# Altium project ATMEGA8高仿PLC控制板.PRJPCB
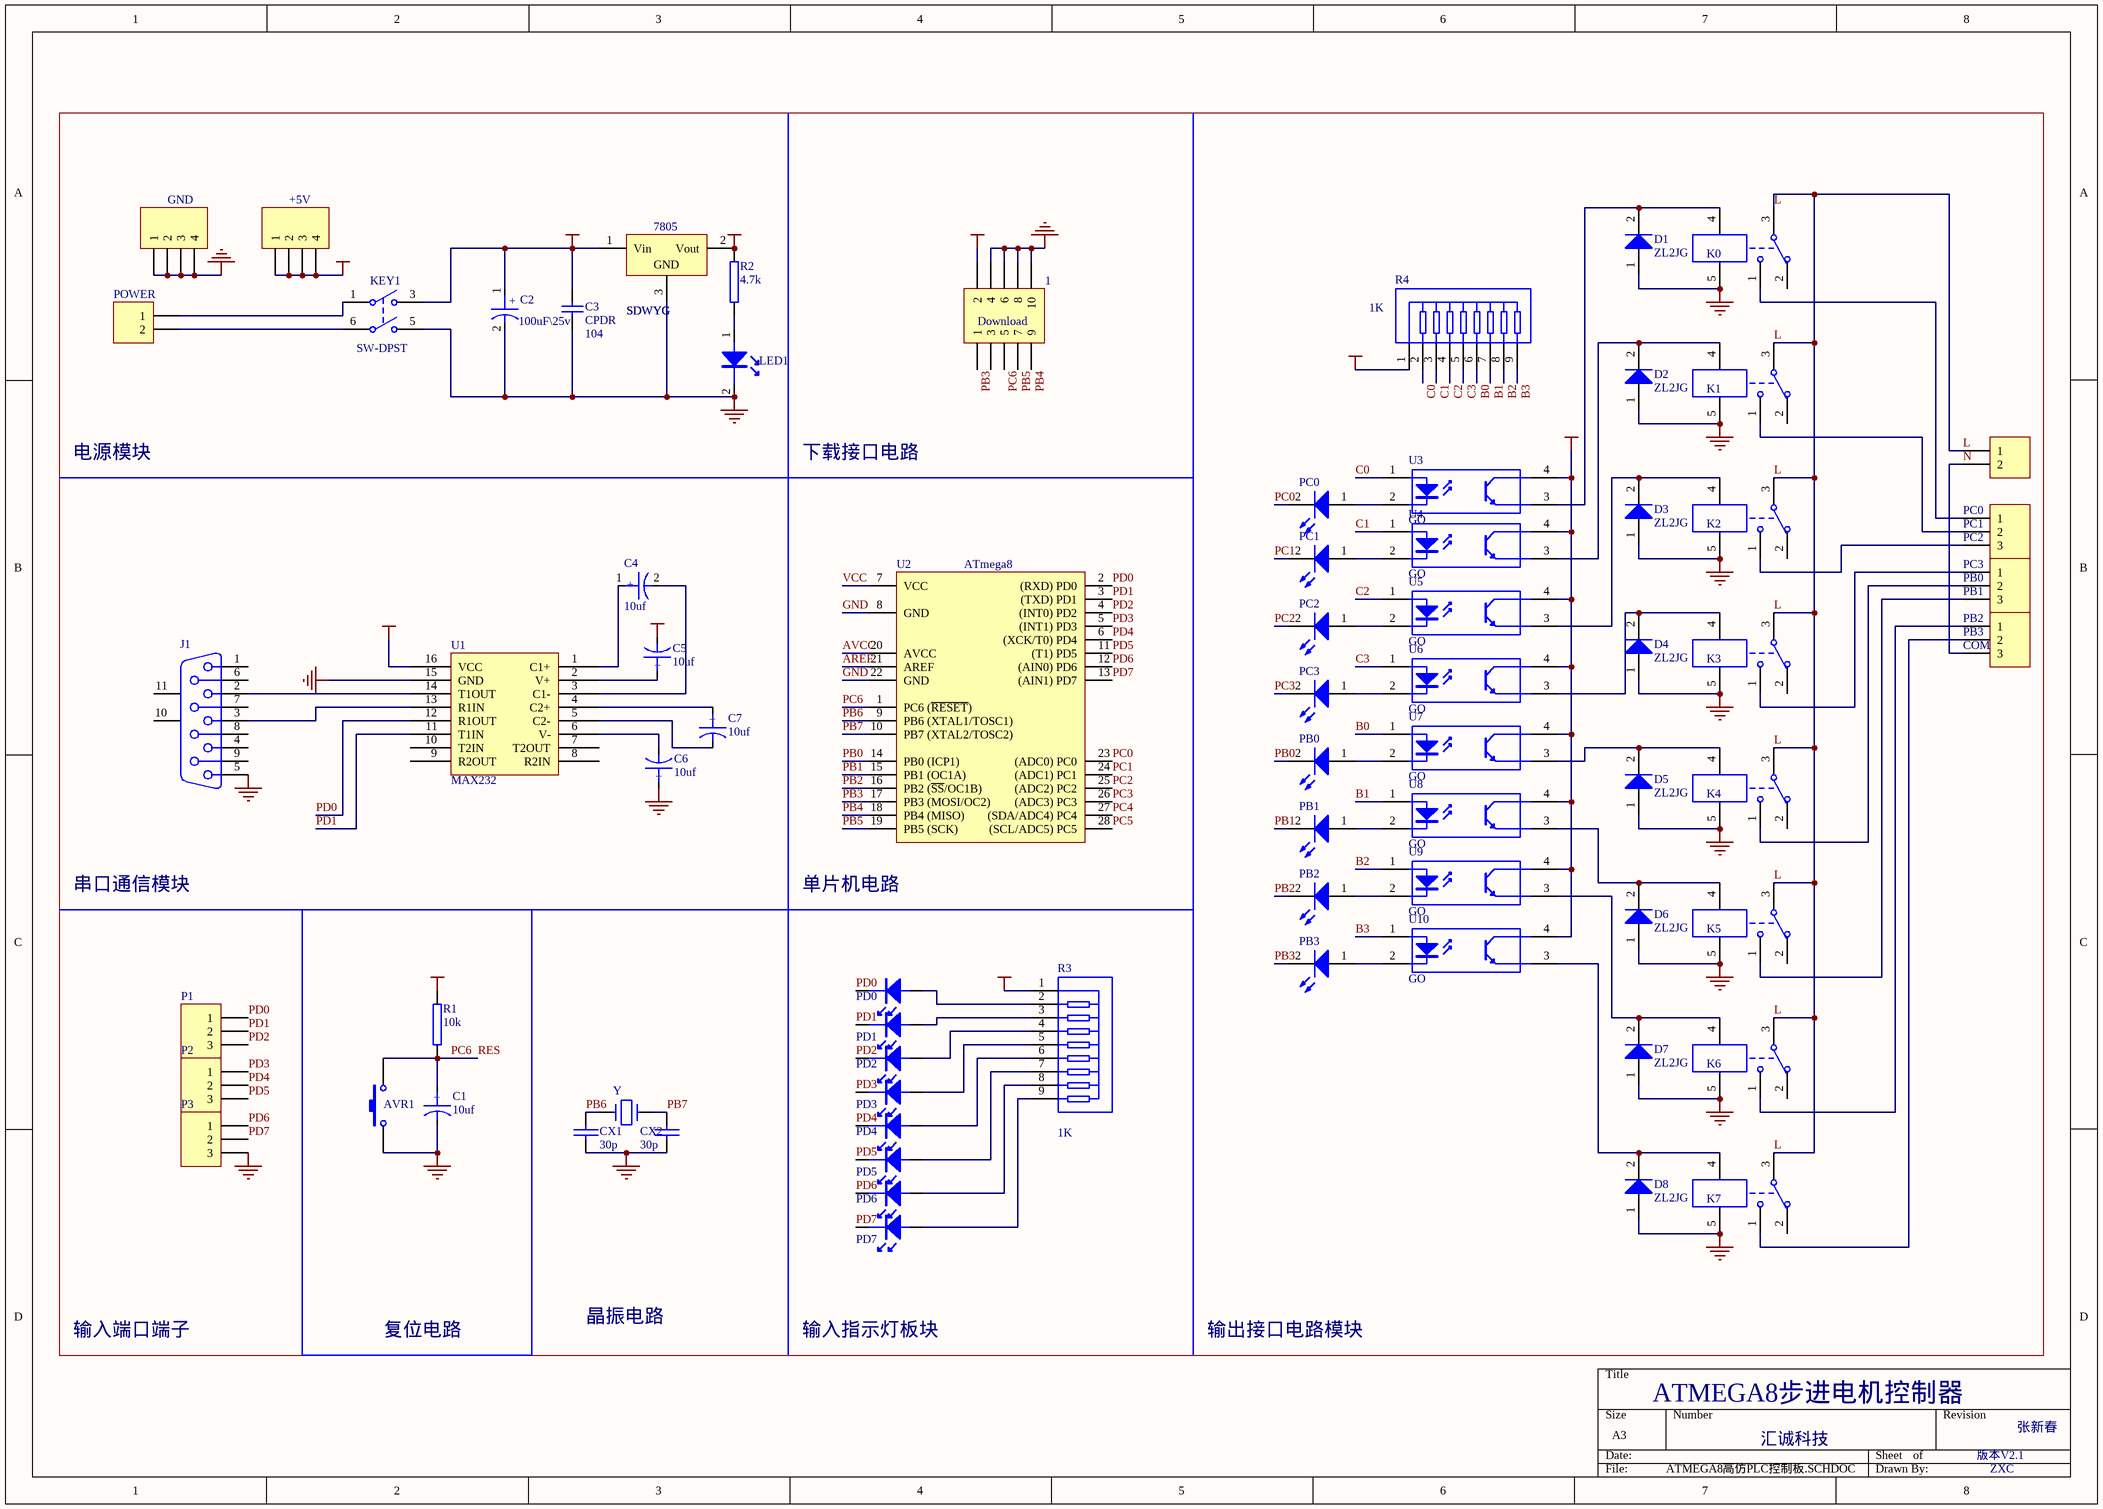
[diagram p0: ATMEGA8高仿PLC控制板.SCHDOC]
1 sheet, 72 parts. Net scope: global (net labels, ports and power ports of the same name join across sheets).
Board file: ATMEGA8高仿PLC控制板.PCBDOC

## Sheet ATMEGA8高仿PLC控制板.SCHDOC: tteter
size A3; DrawnBy: 12222; ertwertw: tertwet; Rule: PcbType=ProtelPcb; Rule: PcbType=ProtelPcb; Rule: PcbType=ProtelPcb; Rule: PcbType=ProtelPcb; Rule: PcbType=ProtelPcb

### Parts
1  Download  [HDR-2x5]
7805  SDWYG  [wyk]
+5V  (no value)  [HDR1X4]
AVR1  (no value)  [an-6*6]
C1  10uf  [C-DJ-4]
C2  100uF\25v  [C-DJ-6]
C3  CPDR  value 104  [CPDR]
C4  10uf  [C-DJ-4]
C5  10uf  [C-DJ-4]
C6  10uf  [C-DJ-4]
C7  10uf  [C-DJ-4]
CX1  30p  [HDR1X2]
CX2  30p  [HDR1X2]
D1  ZL2JG  [D-ZL-10]
D2  ZL2JG  [D-ZL-10]
D3  ZL2JG  [D-ZL-10]
D4  ZL2JG  [D-ZL-10]
D5  ZL2JG  [D-ZL-10]
D6  ZL2JG  [D-ZL-10]
D7  ZL2JG  [D-ZL-10]
D8  ZL2JG  [D-ZL-10]
GND  (no value)  [HDR1X4]
J1  D Connector 9  [DSUB1.385-2H9]  (value not drawn)
K0  JDQYCK  [JQC-3F/T73]  (value not drawn)
K1  JDQYCK  [JQC-3F/T73]  (value not drawn)
K2  JDQYCK  [JQC-3F/T73]  (value not drawn)
K3  JDQYCK  [JQC-3F/T73]  (value not drawn)
K4  JDQYCK  [JQC-3F/T73]  (value not drawn)
K5  JDQYCK  [JQC-3F/T73]  (value not drawn)
K6  JDQYCK  [JQC-3F/T73]  (value not drawn)
K7  JDQYCK  [JQC-3F/T73]  (value not drawn)
KEY1  SW-DPST  [DPDT-6]
LED1  LED  [LED]  (value not drawn)
P1  PZ_3  [JK128_3]
P2  PZ_3  [JK128_3]
P3  (no value)  [JK128_3]
P4  PZ_2  [DYDZ]  (value not drawn)
PB0  (no value)  [CPDR]
PB1  (no value)  [CPDR]
PB2  (no value)  [CPDR]
PB3  (no value)  [CPDR]
PC0  (no value)  [CPDR]
PC1  (no value)  [CPDR]
PC2  (no value)  [CPDR]
PC3  (no value)  [CPDR]
PD0  LED  [HDR1X2]  (value not drawn)
PD1  LED  [HDR1X2]  (value not drawn)
PD2  LED  [HDR1X2]  (value not drawn)
PD3  LED  [HDR1X2]  (value not drawn)
PD4  LED  [HDR1X2]  (value not drawn)
PD5  LED  [HDR1X2]  (value not drawn)
PD6  LED  [HDR1X2]  (value not drawn)
PD7  LED  [HDR1X2]  (value not drawn)
POUT1  PZ_3  [JK128_3]  (value not drawn)
POUT2  PZ_3  [JK128_3]  (value not drawn)
POUT3  PZ_3  [JK128_3]  (value not drawn)
POWER  (no value)  [JK128_2]
R1  10k  [RSE]
R2  4.7k  [RSE]
R3  value 1K  [HDR-10]
R4  value 1K  [HDR-10]
U1  MAX232  [DIP16]
U2  ATmega8  [DIP-28]
U3  GO  [DIP-4]
U4  GO  [DIP-4]
U5  GO  [DIP-4]
U6  GO  [DIP-4]
U7  GO  [DIP-4]
U8  GO  [DIP-4]
U9  GO  [DIP-4]
U10  GO  [DIP-4]
Y1  Y  [JZ_ZC]

### Nets
+12V: 7805.1(Vin) C2.1 C3.2 KEY1.3(NO1) U3.4(C) U4.4(C) U5.4(C) U6.4(C) U7.4(C) U8.4(C) U9.4(C) U10.4(C)
GND: 1.4 1.6 1.8 1.10 7805.3(GND) AVR1.2 C1.2 C2.2 C3.1 C6.1 CX1.2 CX2.2 D1.1(A) D2.1(A) D3.1(A) D4.1(A) D5.1(A) D6.1(A) D7.1(A) D8.1(A) GND.1 GND.2 GND.3 GND.4 J1.5 K0.5 K1.5 K2.5 K3.5 K4.5 K5.5 K6.5 K7.5 KEY1.5(NO2) LED1.2(K) P3.3 U1.15(GND) U2.8(GND) U2.22(GND)
VCC: 1.2 7805.2(Vout) +5V.1 +5V.2 +5V.3 +5V.4 C5.2 R1.2 R2.1 R3.1 R4.1 U1.16(VCC) U2.7(VCC)
AREF: U2.21(AREF)
AVCC: U2.20(AVCC)
B0: R4.6 U7.1(A)
B1: R4.7 U8.1(A)
B2: R4.8 U9.1(A)
B3: R4.9 U10.1(A)
C0: R4.2 U3.1(A)
C1: R4.3 U4.1(A)
C2: R4.4 U5.1(A)
C3: R4.5 U6.1(A)
L: K0.3 K1.3 K2.3 K3.3 K4.3 K5.3 K6.3 K7.3 P4.1
N: P4.2 POUT3.3
PB0: PB0.2(K) U2.14(PB0_(ICP1))
PB1: PB1.2(K) U2.15(PB1_(OC1A))
PB2: PB2.2(K) U2.16(PB2_(~{SS}/OC1B))
PB3: 1.1 PB3.2(K) U2.17(PB3_(MOSI/OC2))
PB4: 1.9 U2.18(PB4_(MISO))
PB5: 1.7 U2.19(PB5_(SCK))
PB6: CX1.1 U2.9(PB6_(XTAL1/TOSC1)) Y1.2
PB7: CX2.1 U2.10(PB7_(XTAL2/TOSC2)) Y1.1
PC0: PC0.2(K) U2.23((ADC0)_PC0)
PC1: PC1.2(K) U2.24((ADC1)_PC1)
PC2: PC2.2(K) U2.25((ADC2)_PC2)
PC3: PC3.2(K) U2.26((ADC3)_PC3)
PC4: U2.27((SDA/ADC4)_PC4)
PC5: U2.28((SCL/ADC5)_PC5)
PC6: 1.5 AVR1.1 C1.1 R1.1 U2.1(PC6_(~{RESET}))  [also labelled RES]
PD0: P1.1 PD0.2(K) U1.12(R1OUT) U2.2((RXD)_PD0)
PD1: P1.2 PD1.2(K) U1.11(T1IN) U2.3((TXD)_PD1)
PD2: P1.3 PD2.2(K) U2.4((INT0)_PD2)
PD3: P2.1 PD3.2(K) U2.5((INT1)_PD3)
PD4: P2.2 PD4.2(K) U2.6((XCK/T0)_PD4)
PD5: P2.3 PD5.2(K) U2.11((T1)_PD5)
PD6: P3.1 PD6.2(K) U2.12((AIN0)_PD6)
PD7: P3.2 PD7.2(K) U2.13((AIN1)_PD7)
NetC4_1: C4.1 U1.1(C1+)
NetC4_2: C4.2 U1.3(C1-)
NetC5_1: C5.1 U1.2(V+)
NetC6_2: C6.2 U1.6(V-)
NetC7_1: C7.1 U1.4(C2+)
NetC7_2: C7.2 U1.5(C2-)
NetD1_2: D1.2(K) K0.4 U3.3(E)
NetD2_2: D2.2(K) K1.4 U4.3(E)
NetD3_2: D3.2(K) K2.4 U5.3(E)
NetD4_2: D4.2(K) K3.4 U6.3(E)
NetD5_2: D5.2(K) K4.4 U7.3(E)
NetD6_2: D6.2(K) K5.4 U8.3(E)
NetD7_2: D7.2(K) K6.4 U9.3(E)
NetD8_2: D8.2(K) K7.4 U10.3(E)
NetJ1_2: J1.2 U1.14(T1OUT)
NetJ1_3: J1.3 U1.13(R1IN)
NetK0_1: K0.1 POUT1.1
NetK1_1: K1.1 POUT1.2
NetK2_1: K2.1 POUT1.3
NetK3_1: K3.1 POUT2.1
NetK4_1: K4.1 POUT2.2
NetK5_1: K5.1 POUT2.3
NetK6_1: K6.1 POUT3.1
NetK7_1: K7.1 POUT3.2
NetKEY1_1: KEY1.1(COMMON1) POWER.1
NetKEY1_6: KEY1.6(COMMON2) POWER.2
NetLED1_1: LED1.1(A) R2.2
NetPB0_1: PB0.1(A) U7.2(K)
NetPB1_1: PB1.1(A) U8.2(K)
NetPB2_1: PB2.1(A) U9.2(K)
NetPB3_1: PB3.1(A) U10.2(K)
NetPC0_1: PC0.1(A) U3.2(K)
NetPC1_1: PC1.1(A) U4.2(K)
NetPC2_1: PC2.1(A) U5.2(K)
NetPC3_1: PC3.1(A) U6.2(K)
NetPD0_1: PD0.1(A) R3.2
NetPD1_1: PD1.1(A) R3.3
NetPD2_1: PD2.1(A) R3.4
NetPD3_1: PD3.1(A) R3.5
NetPD4_1: PD4.1(A) R3.6
NetPD5_1: PD5.1(A) R3.7
NetPD6_1: PD6.1(A) R3.8
NetPD7_1: PD7.1(A) R3.9

Not connected (* = marked no-connect by the designer): 1 3; J1 1 4 6 7 8 9 10(MH1) 11(MH2); K0 2; K1 2; K2 2; K3 2; K4 2; K5 2; K6 2; K7 2; U1 7(T2OUT) 8(R2IN) 9(R2OUT) 10(T2IN)

### Notes on the sheet
- 电源模块
- 下载接口电路
- (near POUT1) PC0
- (near POUT1) PC1
- (near POUT1) PC2
- PC3
- (near POUT2) PB0
- (near POUT2) PB1
- PB2
- (near POUT3) PB3
- (near POUT3) COM
- 串口通信模块
- 单片机电路
- 晶振电路
- 输入端口端子
- 复位电路
- 输入指示灯板块
- 输出接口电路模块
- ATMEGA8步进电机控制器
- 汇诚科技
- 版本V2.1
- 张新春
- ZXC
- (in symbol CAPACITOR POL) +

### Library data of the parts
1 = Header 5X2: Header, 5-Pin, Dual row; Revision: 17-Jul-2002: Re-released for DXP Platform.; Publisher: Altium Limited
7805 = SDWYG: 三端稳压器; Published: 24-Mar-1999; LatestRevisionDate: 17-Jul-2002; LatestRevisionNote: Re-released for DXP Platform.; Publisher: Altium Limited; Code_JEDEC: SMD-220
+5V GND = Header 4: Header, 4-Pin; Revision: 17-Jul-2002: Re-released for DXP Platform.; Publisher: Altium Limited
AVR1 = SW-PB: Switch; Published: 24-Mar-1999; LatestRevisionDate: 17-Jul-2002; LatestRevisionNote: Re-released for DXP Platform.; Publisher: Altium Limited
C1 C2 C4-C7 = CAPACITOR POL: Capacitor
C3 = CPDR: 瓷片电容; Published: 8-Jun-2000; LatestRevisionDate: 17-Jul-2002; LatestRevisionNote: Re-released for DXP Platform.; Publisher: Altium Limited
CX1 CX2 = CAP: Capacitor
D1-D8 = ZL2JG: 整流二极管; Published: 8-Jun-2000; LatestRevisionDate: 17-Jul-2002; LatestRevisionNote: Re-released for DXP Platform.; DatasheetDocument: 1998; PackageDocument: Aug-1999; PackageReference: DO-201AD; Publisher: Altium Limited
J1 = D Connector 9: Receptacle Assembly, 9 Position, Right Angle; Package Information: Latest Revision: O; Positions: 9; Published: 15-Jun-2001; Revision: 17-Jul-2002: Re-released for DXP Platform.; Datasheet: (1-Sep-1999); Package Reference: 788750; Publisher: Altium Limited; Orientation: Right Angle; Gender: Receptacle
K0-K7 = JDQYCK: 继电器——1常开1常闭; Published: 24-Mar-1999; LatestRevisionDate: 17-Jul-2002; LatestRevisionNote: Re-released for DXP Platform.; Publisher: Altium Limited
KEY1 = SW-DPST: Double-Pole, Single-Throw Switch; Published: 24-Mar-1999; Revision: July-2002: Re-released for DXP Platform.; Publisher: Altium Limited
P1-P3 POUT1-POUT3 = PZ_3: 排针——3; LatestRevisionDate: 17-Jul-2002; LatestRevisionNote: Re-released for DXP Platform.; Publisher: Altium Limited
P4 = PZ_2: 排针——2; LatestRevisionDate: 17-Jul-2002; LatestRevisionNote: Re-released for DXP Platform.; Publisher: Altium Limited
PB0-PB3 PC0-PC3 = LED: 发光二极管; Published: 8-Jun-2000; LatestRevisionDate: 17-Jul-2002; LatestRevisionNote: Re-released for DXP Platform.; Publisher: Altium Limited
POWER = Header 2: Header, 2-Pin; LatestRevisionDate: 17-Jul-2002; LatestRevisionNote: Re-released for DXP Platform.; Publisher: Altium Limited
R1 R2 = RES2
R3 R4 = Res PZ_8: 8位排阻; Published: 24-Mar-1999; LatestRevisionDate: 17-Jul-2002; LatestRevisionNote: Re-released for DXP Platform.; Publisher: Altium Limited; Code_JEDEC: MO-150-AC
U2 = ATmega8-P: 8 位微处理器/28引脚; 子类别: 微处理器; 发布者: 磊元工作室; 发布日期: 2003年8月18日; 制造商: Atmel Corporation; 类别: 集成电路; 元件名称（国标）: 8 位微处理器; 元件名称（英文）: 8-bit Microcontroller; 特性:存储器容量: Flash：8KB ，EEPROM：512B ，RAM：1KB; 特性:定时器/计数器: 2 个 8-bit ，1 个 16-bit; 特性:模/数转换器: 6 通道 10-bit ADC; 特性:指令: 两个时钟周期的硬件乘法器
U3-U10 = GO: 光耦; Published: 24-Mar-1999; LatestRevisionDate: 17-Jul-2002; LatestRevisionNote: Re-released for DXP Platform.; Publisher: Altium Limited
Y1 = CRYSTAL